# EAGLE design mux smd (EAGLE 7.5.0)
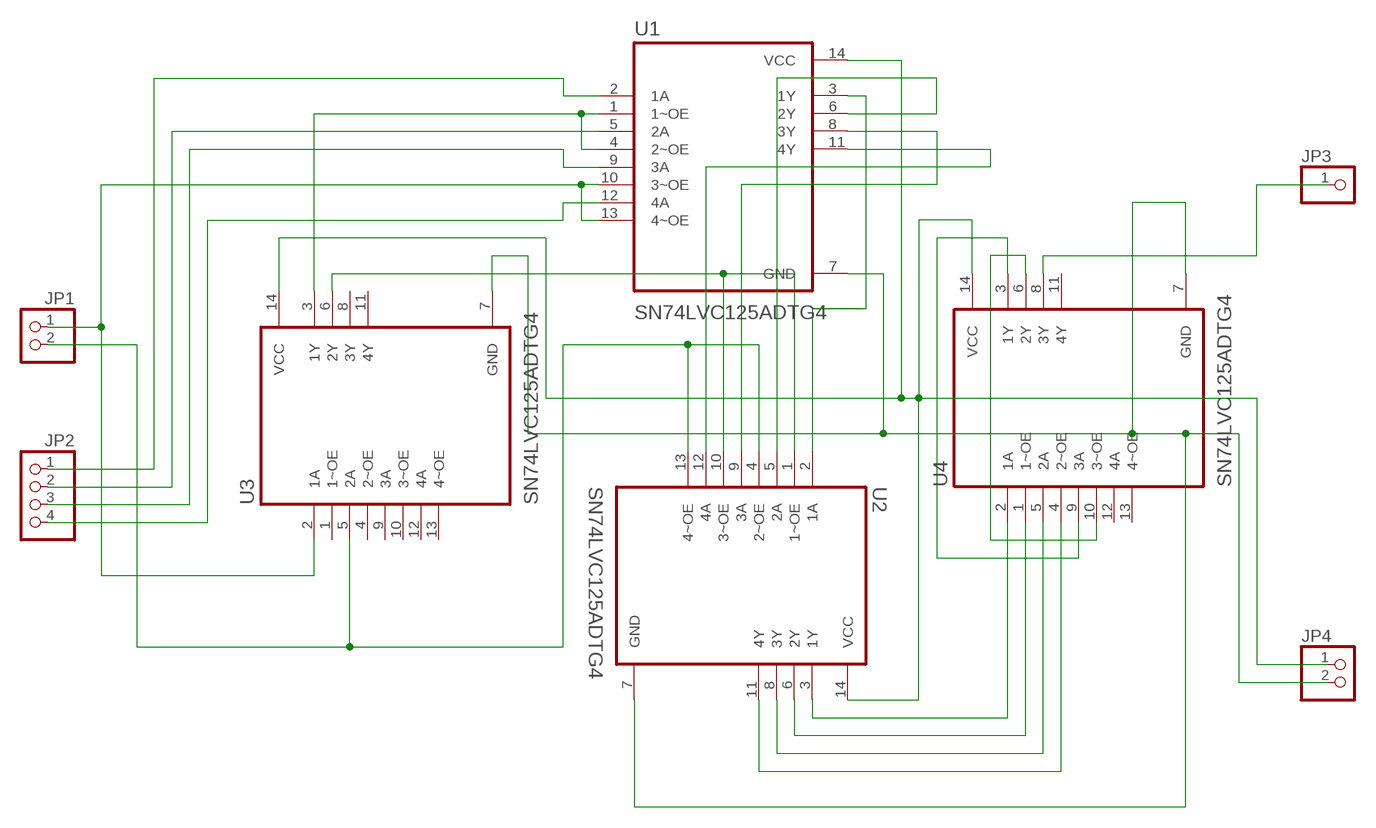
[diagram p0: schematic, sheet 1]

## Parts
JP1  PINHD-1X2  [1X02]
JP2  PINHD-1X4  [1X04]
JP3  PINHD-1X1  [1X01]
JP4  PINHD-1X2  [1X02]
U1  SN74LVC125ADTG4  [SOIC127P600X175-14N]
U2  SN74LVC125ADTG4  [SOIC127P600X175-14N]
U3  SN74LVC125ADTG4  [SOIC127P600X175-14N]
U4  SN74LVC125ADTG4  [SOIC127P600X175-14N]

## Nets
N$1: JP4.1 U1.14(VCC) U2.14(VCC) U3.14(VCC) U4.14(VCC)
N$2: JP2.3 U1.9(3A)
N$3: JP2.4 U1.12(4A)
N$4: JP1.1 U1.10(3~OE) U1.13(4~OE) U3.2(1A)
N$5: JP4.2 U1.7(GND) U2.7(GND) U3.7(GND) U4.7(GND)
N$6: JP2.1 U1.2(1A)
N$7: JP2.2 U1.5(2A)
N$8: U1.1(1~OE) U1.4(2~OE) U3.3(1Y)
N$9: U1.3(1Y) U2.2(1A)
N$10: U1.8(3Y) U2.9(3A)
N$11: U1.6(2Y) U2.5(2A)
N$12: U1.11(4Y) U2.12(4A)
N$13: JP1.2 U2.4(2~OE) U2.13(4~OE) U3.5(2A)
N$14: U2.1(1~OE) U2.10(3~OE) U3.6(2Y)
N$15: U2.3(1Y) U4.2(1A)
N$16: U2.6(2Y) U4.1(1~OE)
N$17: U2.8(3Y) U4.5(2A)
N$18: U2.11(4Y) U4.4(2~OE)
N$19: U4.3(1Y) U4.9(3A)
N$20: U4.6(2Y) U4.10(3~OE)
N$21: JP3.1 U4.8(3Y)
Unconnected: U3.1(1~OE) U3.4(2~OE) U3.8(3Y) U3.9(3A) U3.10(3~OE) U3.11(4Y) U3.12(4A) U3.13(4~OE) U4.11(4Y) U4.12(4A) U4.13(4~OE)

## Library data of the parts
JP1 JP4 = pinhead:PINHD-1X2: PIN HEADER
JP2 = pinhead:PINHD-1X4: PIN HEADER
JP3 = pinhead:PINHD-1X1: PIN HEADER
U1-U4 = SN74LVC125ADTG4:SN74LVC125ADTG4: Check availability <https://pricing.snapeda.com/parts/SN74LVC125ADTG4/Texas%20Instruments/view-part?ref=eda>; AVAILABILITY: In Stock; DESCRIPTION: Quadruple Bus Buffer Gate With 3-State Outputs 14-SOIC -40 to 125; MF: Texas Instruments; MP: SN74LVC125ADTG4; PACKAGE: SOIC-14 Texas Instruments; PRICE: None; PURCHASE-URL: https://pricing.snapeda.com/search/part/SN74LVC125ADTG4/?ref=eda

## Net classes
0 default: width 0.4 mm, clearance 0.25 mm

## Board
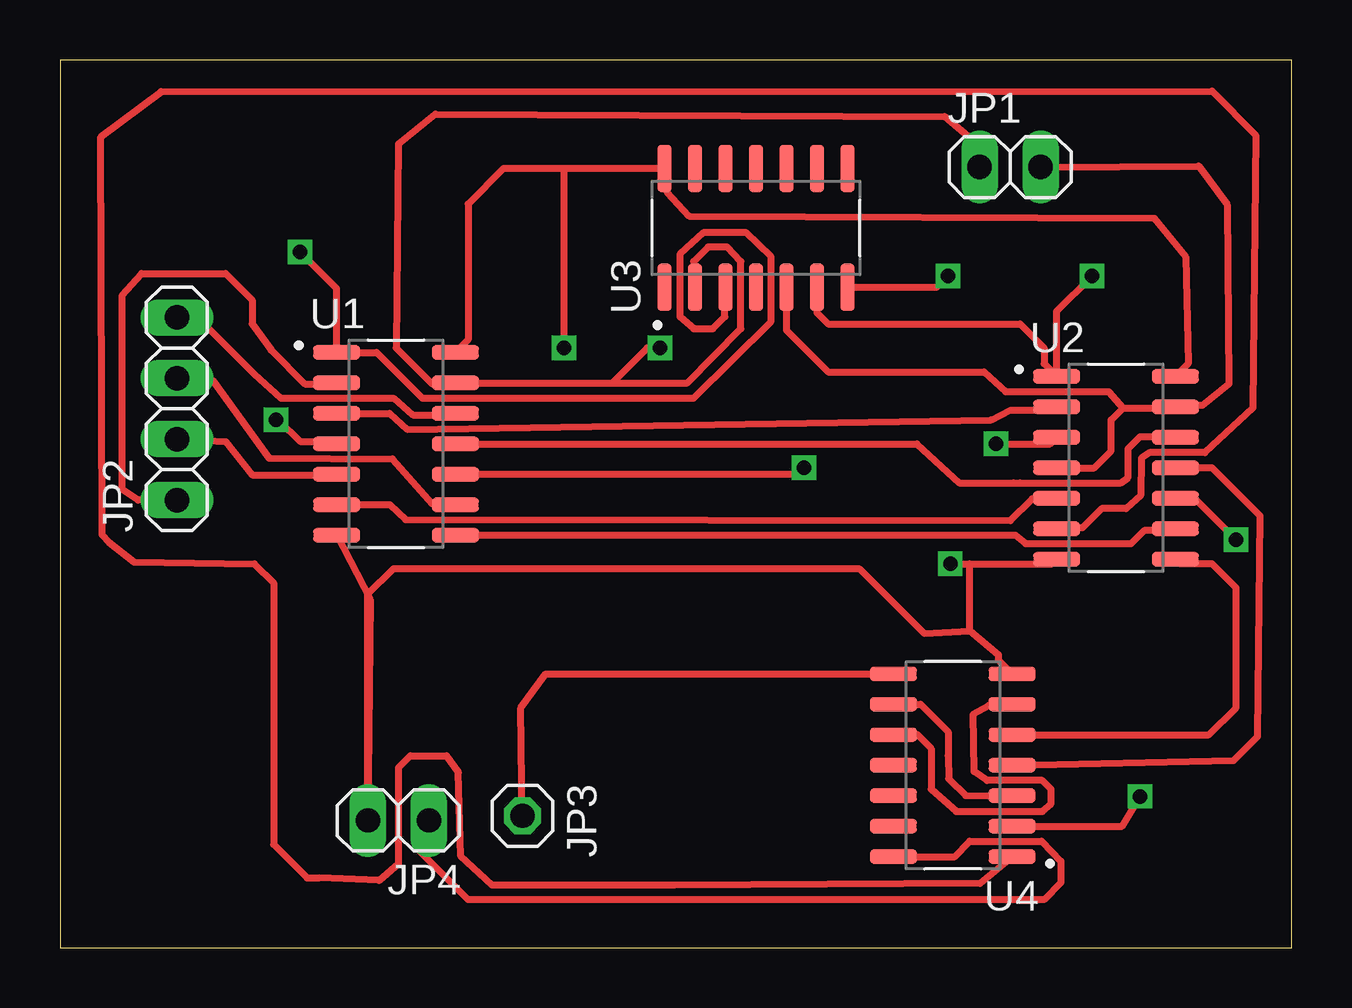
[diagram p1: board, top side]
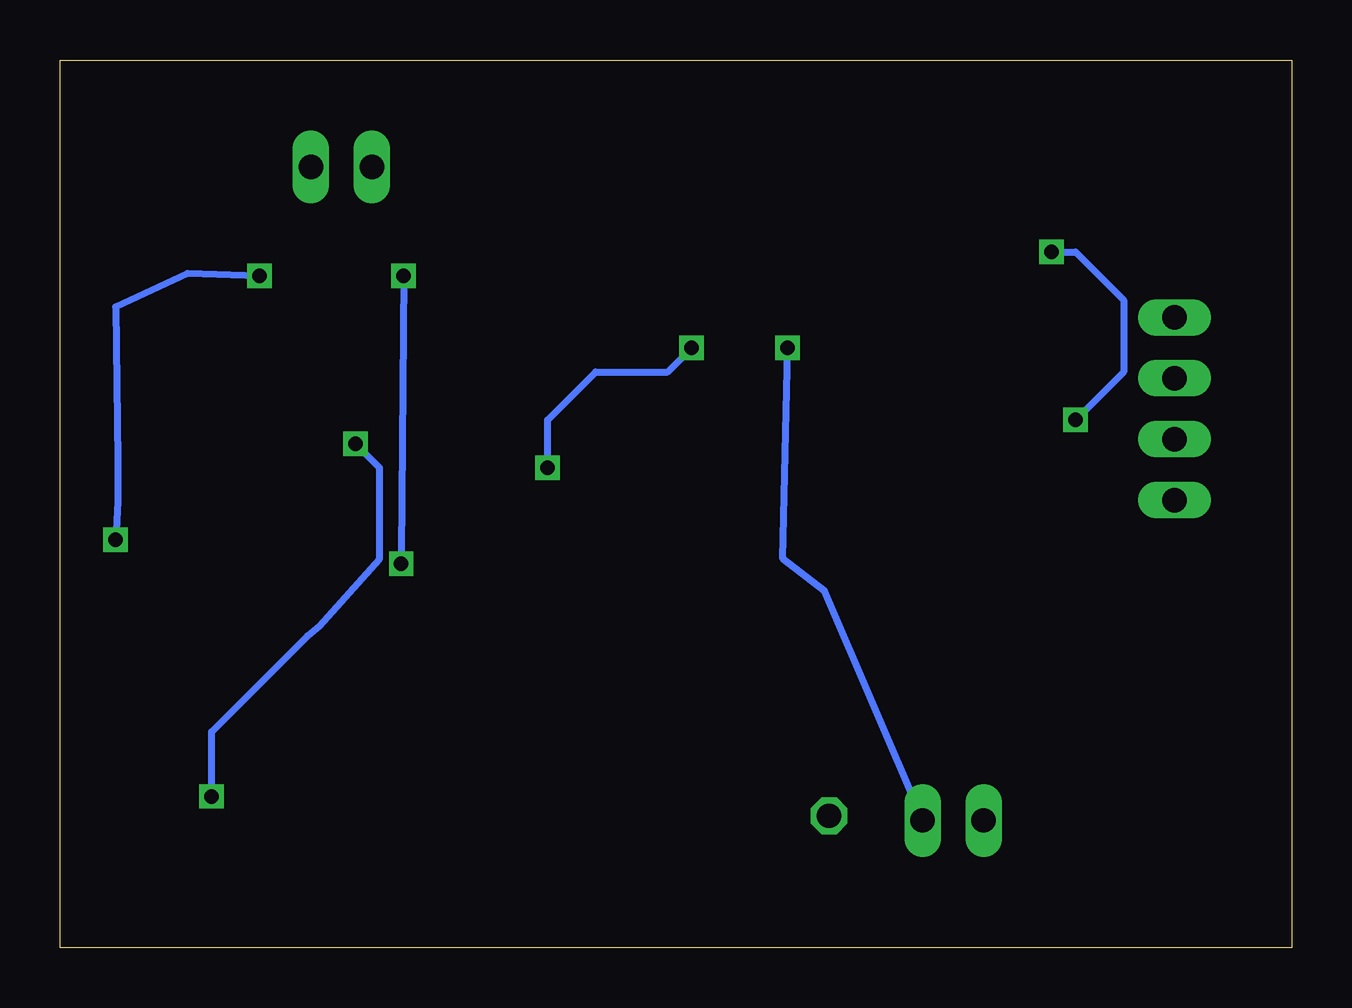
[diagram p2: board, bottom side, seen from below]

Size 51.31 x 37 mm. Coordinates in mm from the lower left corner, seen from the top.
Outline: 0,0 51.31,0 51.31,37 0,37 0,0
Copper layers (1*16): Top 0.035mm / dielectric 1.5mm / Bottom 0.035mm
Design rules "default": minimum track width 10mil, minimum drill 24mil, track to track 8mil, track to pad 8mil, pad to pad 8mil, via to via 8mil, smd to smd 8mil, copper to edge 40mil, drill to drill 8mil, minimum pad ring 10mil, minimum via ring 8mil, stop-mask expansion 4mil, vias tented up to drill 0mil, thermal gap 10mil

### Footprints (pad centres in the part's own frame; a part is rotated, then mirrored left to right if it is on the bottom)
1X02 = drill 1.016 long: 1 -1.27,0; 2 1.27,0
1X04 = drill 1.016 long: 1 -3.81,0; 2 -1.27,0; 3 1.27,0; 4 3.81,0
1X01 = drill 1.016 octagon: 1 0,0
SOIC127P600X175-14N = smd 1.97 x 0.6: 1 -2.475,3.81; 2 -2.475,2.54; 3 -2.475,1.27; 4 -2.475,0; 5 -2.475,-1.27; 6 -2.475,-2.54; 7 -2.475,-3.81; 8 2.475,-3.81; 9 2.475,-2.54; 10 2.475,-1.27; 11 2.475,0; 12 2.475,1.27; 13 2.475,2.54; 14 2.475,3.81

### Placement (x,y rotation side)
JP1  39.59,32.54 0 top
JP2  4.87,22.46 90 top
JP3  19.27,5.49 270 top
JP4  14.1,5.3 180 top
U1  14,21 0 top
U2  44,20 0 top
U3  29,30 90 top
U4  37.2,7.6 180 top

### Tracks (layer width: path | path; a pad name or v marks a point on that pad's centre or on a via)
N$1  (via drill 0.6)
  Top 0.3: U2.14 47,24.34 46.9,28.8 45.6,30.4 26.2,30.5 25.29,31.49 U3.14 21,32.48 | 21,32.48 18.48,32.48 17,31 17,25.34 U1.14 | v21,25 21,32.48 | U4.14 37.29,3.79 37.9,4.43 40.9,4.43 41.7,3.6 41.7,2.7 41,2 17,2 15,4 15,4.93 JP4.1
  Bottom 0.3: JP4.1 19.47,14.87 21.2,16.2 v21,25
N$2
  Top 0.3: JP2.3 6.37,23.63 8.71,20.4 13.85,20.36 15.5,18.5 16.43,18.5 U1.9
N$3
  Top 0.3: JP2.4 5.83,26.17 8.1,23.9 9.2,22.9 13.9,22.9 14.7,22.2 16.41,22.2 U1.12
N$4  (via drill 0.6)
  Top 0.3: 23,23.54 U1.13 16.43,23.5 15.5,23.5 14,25 14.1,33.5 15.64,34.74 36.86,34.64 38.1,33.6 38.2,32.66 JP1.1 | 23,23.54 26.14,23.54 28.36,25.8 28.36,28.6 27.8,29.2 27,29.2 26.4,28.6 26.4,27.59 U3.2 | U1.10 30.73,19.73 v31,20 | v25,25 24.46,25 23,23.54
  Bottom 0.3: v31,20 31,22 29,24 26,24 v25,25
N$5  (via drill 0.6)
  Top 0.3: U1.7 12.93,14.51 JP4.2 12.83,14.73 13.9,15.8 33.3,15.8 36,13.1 37.9,13.2 | 37.9,13.2 39.1,12.2 39.1,11.98 U4.7 | 37.9,13.2 37.9,16 | 37.9,16 41.34,16 U2.7 | U3.7 36.52,27.52 v37,28 | v37.1,16 37.9,16
  Bottom 0.3: v37,28 37.1,16.4 v37.1,16
N$6
  Top 0.3: JP2.1 3.25,18.65 2.6,19.1 2.6,27.2 3.4,28.1 6.9,28.1 8,27 8,26 8.8,24.9 10.2,23.5 11.48,23.5 U1.2
N$7
  Top 0.3: JP2.2 6.91,21.09 8,19.7 11.26,19.7 U1.5
N$8  (via drill 0.6)
  Top 0.3: U3.3 27.7,27.5 27.7,26.3 27.2,25.8 26.4,25.8 25.83,26.3 25.83,28.9 26.8,29.8 28.6,29.8 29.64,28.8 29.64,26.1 26.4,22.9 15.1,22.9 13.19,24.81 U1.1 11.53,27.48 v10,29 | v9,22 9.1,22 10,21.1 11.43,21.1 U1.4
  Bottom 0.3: v10,29 9,29 7,27 7,24 v9,22
N$9
  Top 0.3: U1.3 13.73,22.27 14.47,21.6 38.8,22 39.6,22.4 41.38,22.4 U2.2
N$10
  Top 0.3: U1.8 39.81,17.19 40.23,16.84 44.63,16.84 45.2,17.4 46.9,17.4 47,17.5 46.52,17.5 U2.9
N$11
  Top 0.3: U1.6 13.74,18.46 14.4,17.84 39.6,17.8 40.5,18.7 41.49,18.7 U2.5
N$12
  Top 0.3: U1.11 35.7,21 37.47,19.38 39.73,19.38 40,19.37 44.2,19.37 44.5,19.6 44.5,20.8 45,21.3 46.45,21.3 U2.12
N$13
  Top 0.3: JP1.2 47.45,32.58 48.63,30.98 48.7,23.5 47.6,22.6 46.53,22.6 U2.13 46.44,22.5 44.3,22.5 | U2.4 43.1,20 43.8,20.7 43.8,22 44.3,22.5 | U3.5 30.27,25.73 32,24 38.5,24 39.4,23.17 43.7,23.17 44.3,22.5
N$14  (via drill 0.6)
  Top 0.3: U3.6 31.54,26.46 32,26 40,26 41,25 41,24.34 U2.1 41.52,26.52 v43,28 | v49,17 47.3,18.7 46.51,18.7 U2.10
  Bottom 0.3: v43,28 46,28.1 49,26.7 48.9,20.3 48.9,18.6 v49,17
N$15  (via drill 0.6)
  Top 0.3: U4.2 44.26,5.06 v45,6.3 | v39,21 41.26,21 U2.3
  Bottom 0.3: v45,6.3 45,9 41,13 40.5,13.4 38,16.2 38,20 v39,21
N$16
  Top 0.3: U4.1 38.34,2.67 25.6,2.6 18,2.6 16.7,3.8 16.6,7.3 16.1,8 14.6,8 14.1,7.5 14.1,3.5 13.3,2.8 10.8,2.9 10.3,2.9 8.9,4.3 8.9,15.2 8.1,16 3.08,16.07 2.04,16.91 1.76,17.2 1.7,33.8 4.21,35.69 48,35.7 49.81,33.87 49.7,22.5 47.7,20.64 45.4,20.64 45.06,20.4 45.02,18.84 44.42,18.3 43.4,18.3 42.6,17.5 41.56,17.5 U2.6
N$17
  Top 0.3: U4.5 47.87,8.87 49,10 49,15 48,16 46.66,16 U2.8
N$18
  Top 0.3: U4.4 48.9,7.8 49.9,8.8 50,18 48,20 U2.11
N$19
  Top 0.3: U4.9 35.86,10.14 37,9 37,8 37.03,7.04 37.73,6.33 39.65,6.3 U4.3
N$20
  Top 0.3: U4.10 35.73,8.87 36.3,8.3 36.3,6.6 37.34,5.67 40.94,5.67 41.3,6 41.3,6.6 40.94,6.96 38.63,6.96 38.09,7.33 38.05,9.73 38.7,10.1 39.63,10.1 U4.6
N$21
  Top 0.3: JP3.1 19.27,5.27 19.2,10 20.23,11.4 U4.8